# EAGLE design Due_RS422_Transceiver (EAGLE 9.5.2)
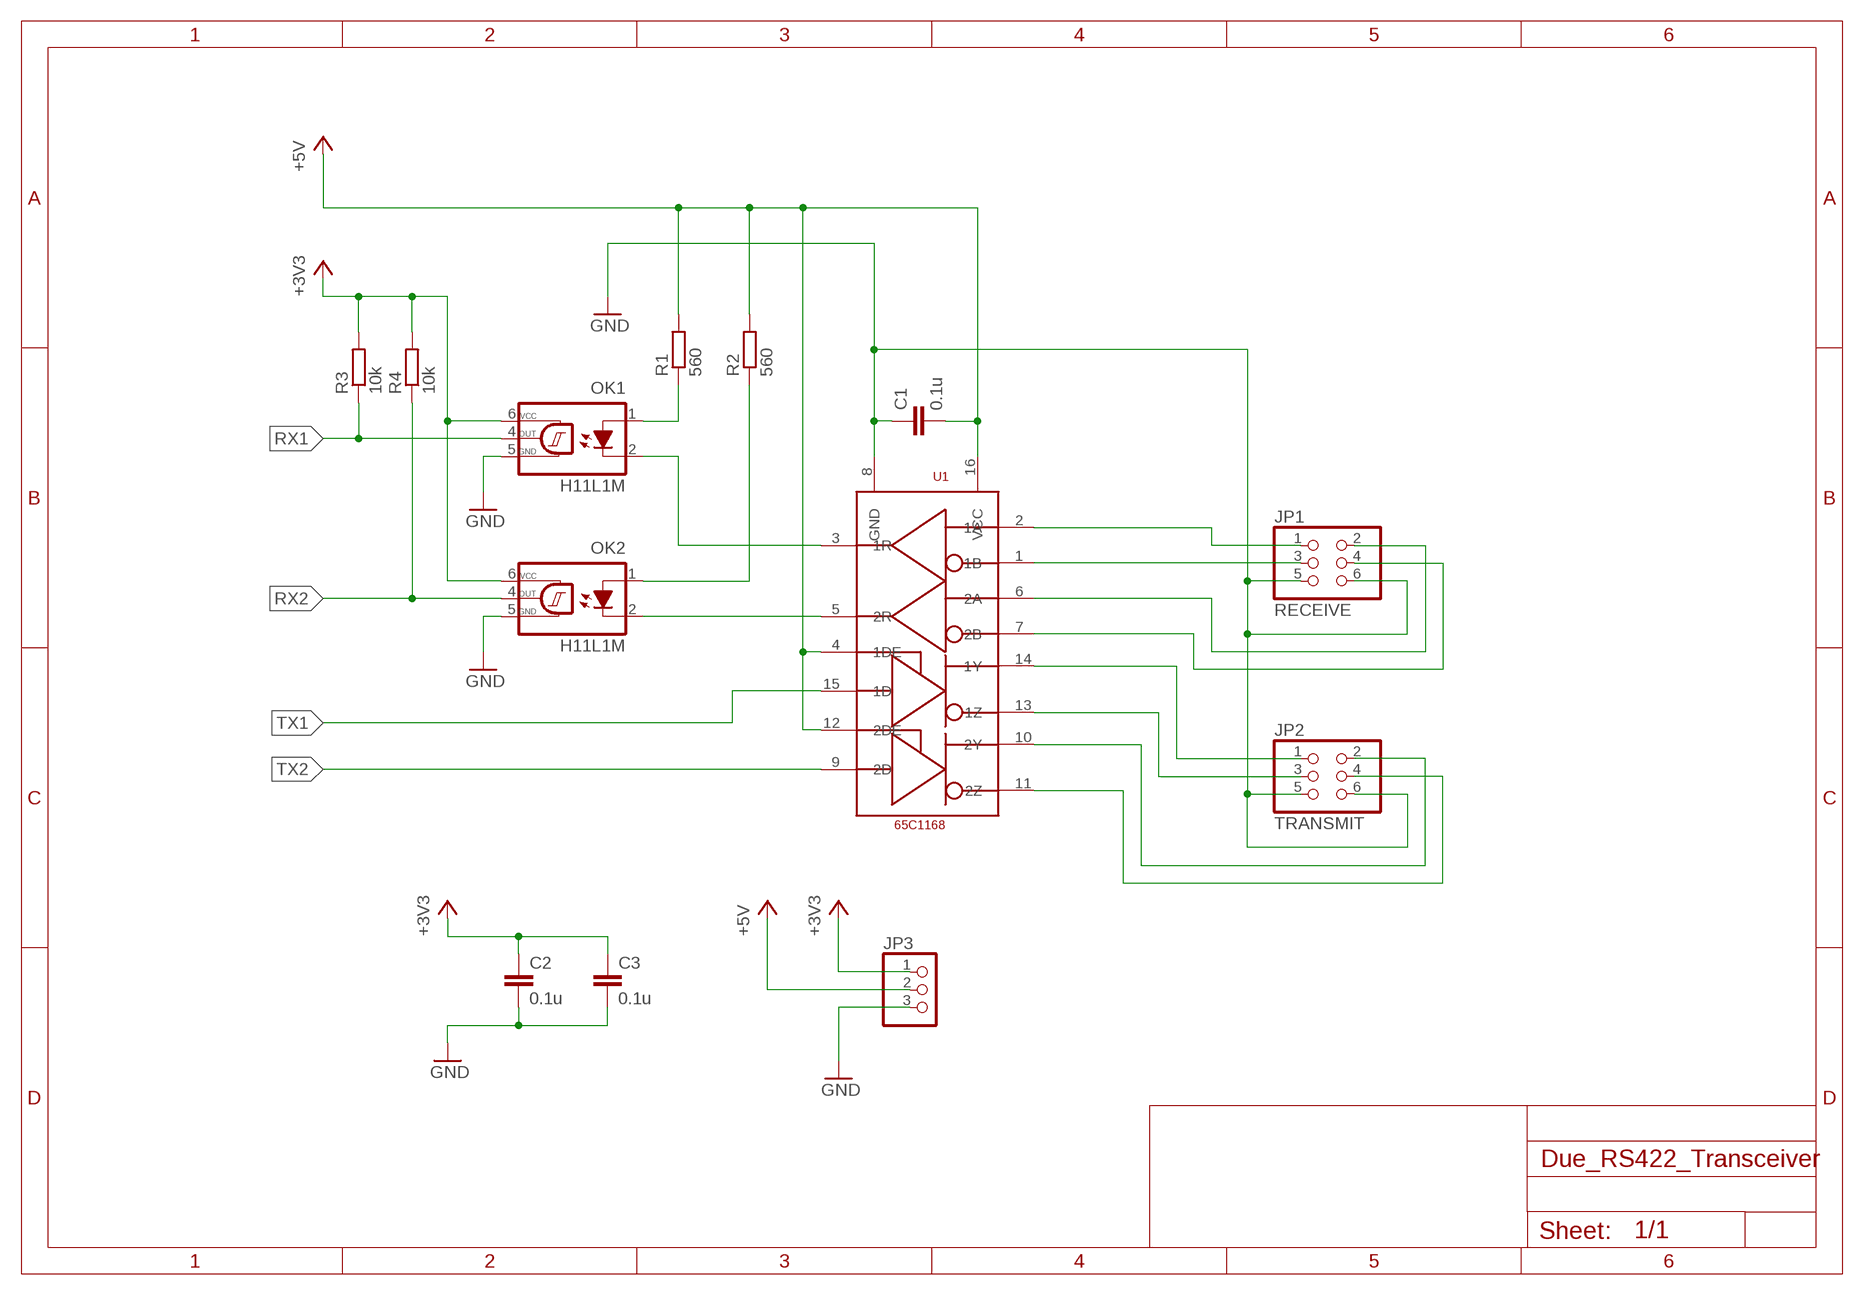
[diagram p0: schematic, sheet 1]

## Parts
C1  0.1u  C-EU050-030X075  [C050-030X075]
C2  0.1u  C-EU050-030X075  [C050-030X075]
C3  0.1u  C-EU050-030X075  [C050-030X075]
JP1  RECEIVE  PINHD-2X3  [2X03]
JP2  TRANSMIT  PINHD-2X3  [2X03]
JP3  PINHD-1X3  [1X03]
OK1  H11L1M  [DIL06]
OK2  H11L1M  [DIL06]
R1  560  R-EU_0204/7  [0204/7]
R2  560  R-EU_0204/7  [0204/7]
R3  10k  R-EU_0204/7  [0204/7]
R4  10k  R-EU_0204/7  [0204/7]
U1  65C1168  SN65C1168  [DIP16]

## Nets
+3V3: C2.1 C3.1 JP3.1 OK1.6(VCC) OK2.6(VCC) R3.2 R4.2
+5V: C1.2 JP3.2 R1.2 R2.2 U1.4(1DE) U1.12(2DE) U1.16(VCC)
GND: C1.1 C2.2 C3.2 JP1.5 JP1.6 JP2.5 JP2.6 JP3.3 OK1.5(GND) OK2.5(GND) U1.8(GND)
N$1: OK1.2(C) U1.3(1R)
N$2: OK2.2(C) U1.5(2R)
N$3: OK1.1(A) R1.1
N$4: OK2.1(A) R2.1
N$8: JP1.3 U1.1(1B)
N$9: JP1.1 U1.2(1A)
N$10: JP1.2 U1.6(2A)
N$11: JP1.4 U1.7(2B)
N$12: JP2.1 U1.14(1Y)
N$13: JP2.3 U1.13(1Z)
N$14: JP2.2 U1.10(2Y)
N$15: JP2.4 U1.11(2Z)
RX1: OK1.4(OUT) R3.1
RX2: OK2.4(OUT) R4.1
TX1: U1.15(1D)
TX2: U1.9(2D)

## Library data of the parts
C1-C3 = rcl:C-EU: CAPACITOR, European symbol; SPICEPREFIX: C
JP1 JP2 = pinhead:PINHD-2X3: PIN HEADER
JP3 = pinhead:PINHD-1X3: PIN HEADER
OK1 OK2 = optocoupler:H11L*M: 6-Pin DIP Optocoupler Source: http://www.fairchildsemi.com/ds/H1/H11L2-M.pdf; MF: FAIRCHILD SEMICONDUCTOR; MPN: H11L1-M; OC_FARNELL: 1021127; OC_NEWARK: 72K8643
R1-R4 = rcl:R-EU_: RESISTOR, European symbol; SPICEPREFIX: R
U1 = sb2030_logger:SN65C1168

## Board
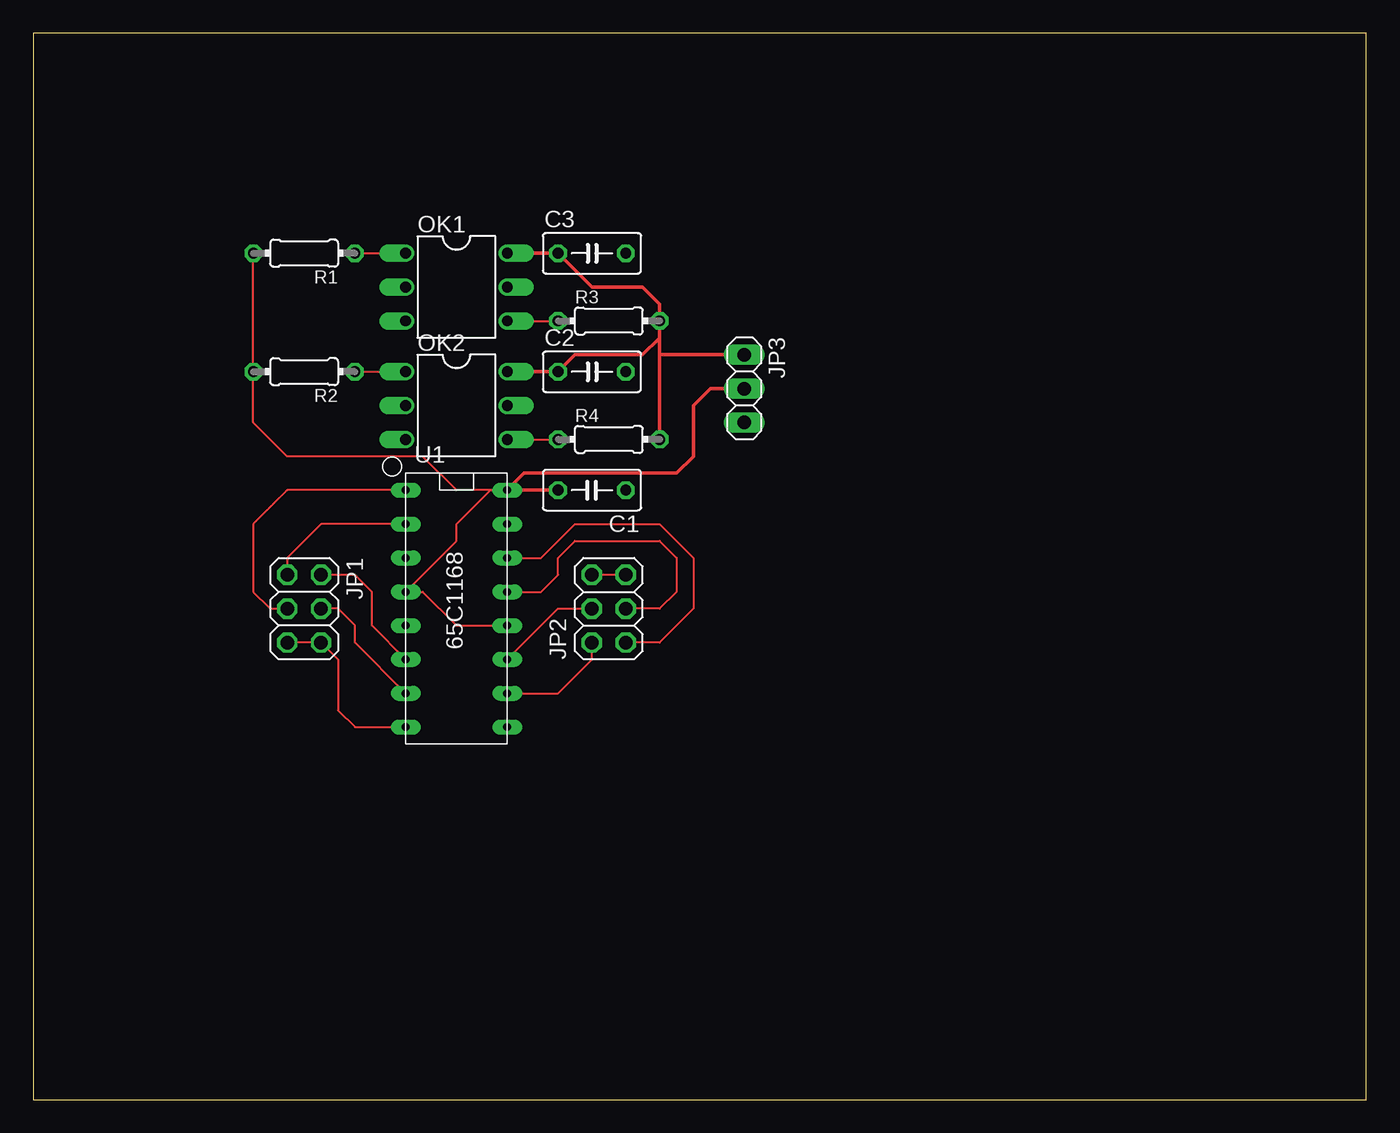
[diagram p1: board, top side]
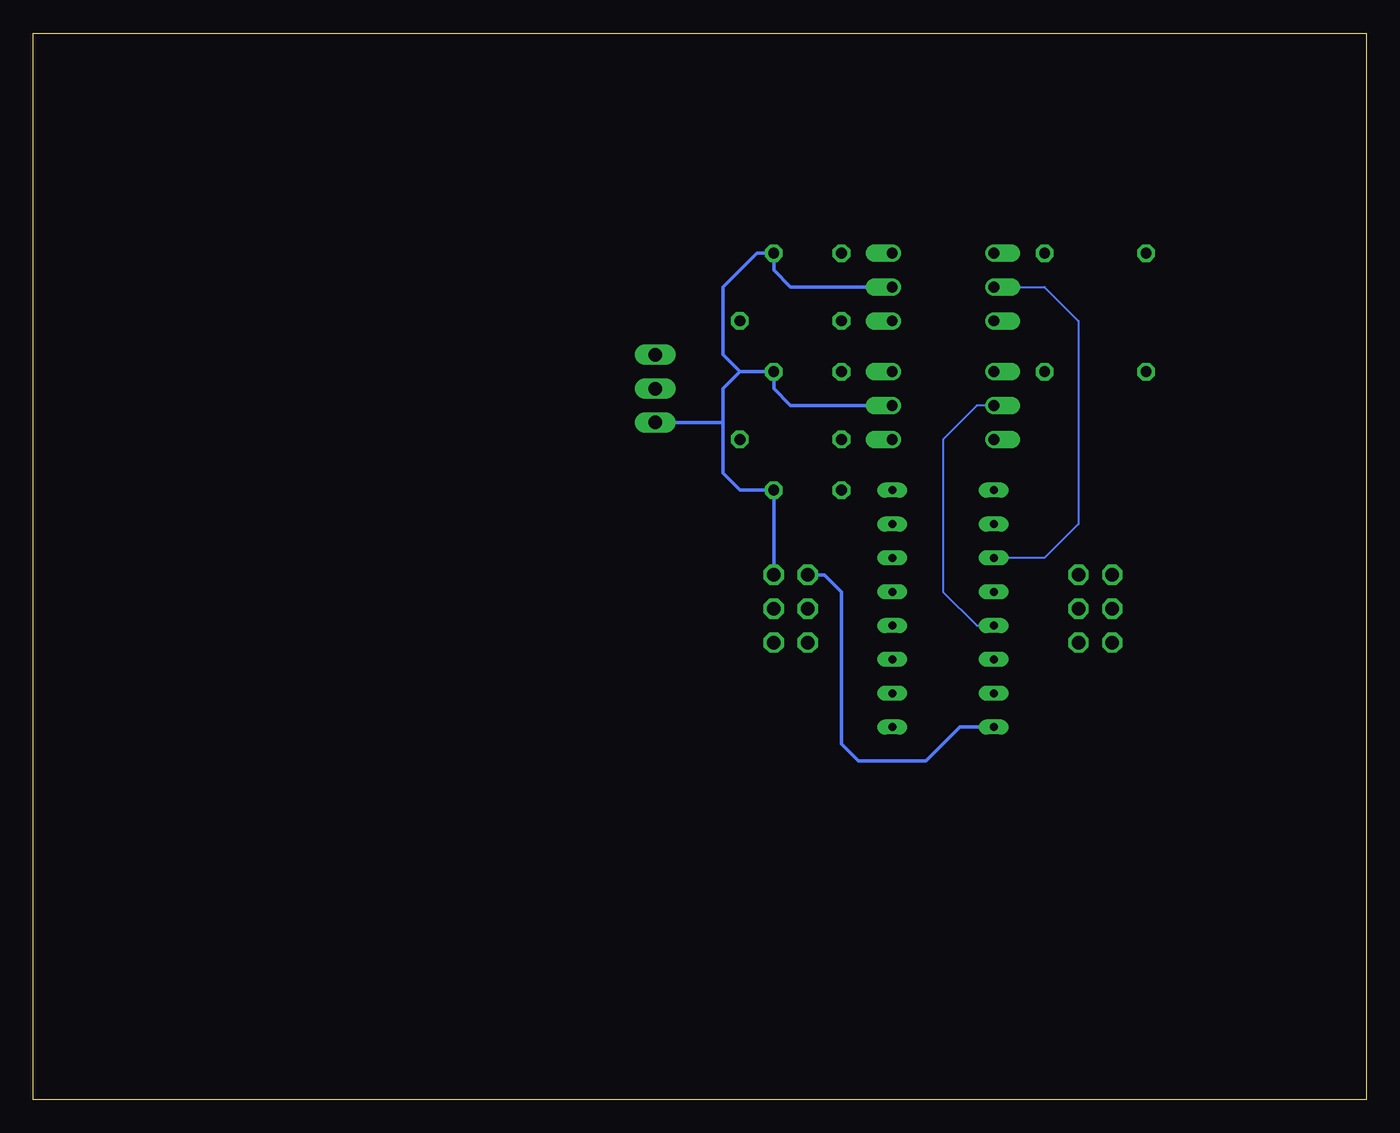
[diagram p2: board, bottom side, seen from below]

Size 100 x 80 mm. Coordinates in mm from the lower left corner, seen from the top.
Outline: 0,0 100,0 100,80 0,80 0,0
Copper layers (1*16): Top 0.035mm / dielectric 1.5mm / Bottom 0.035mm
Design rules "default": minimum track width 6mil, minimum drill 0.35mm, track to track 6mil, track to pad 6mil, pad to pad 6mil, via to via 6mil, smd to smd 6mil, copper to edge 40mil, drill to drill 6mil, minimum pad ring 10mil, minimum via ring 8mil, stop-mask expansion 4mil, vias tented up to drill 0mil, thermal gap 10mil

### Footprints (pad centres in the part's own frame; a part is rotated, then mirrored left to right if it is on the bottom)
C050-030X075 = drill 0.813 octagon: 1 -2.54,0; 2 2.54,0
2X03 = drill 1.016 octagon: 1 -2.54,-1.27; 2 -2.54,1.27; 3 0,-1.27; 4 0,1.27; 5 2.54,-1.27; 6 2.54,1.27
1X03 = drill 1.016 long: 1 -2.54,0; 2 0,0; 3 2.54,0
DIL06 = drill 0.813 offset: 1 -2.54,-3.81; 2 0,-3.81; 3 2.54,-3.81; 4 2.54,3.81; 5 0,3.81; 6 -2.54,3.81
0204/7 = drill 0.813 octagon: 1 -3.81,0; 2 3.81,0
DIP16 = drill 0.6 long: 1 -3.81,8.89; 2 -3.81,6.35; 3 -3.81,3.81; 4 -3.81,1.27; 5 -3.81,-1.27; 6 -3.81,-3.81; 7 -3.81,-6.35; 8 -3.81,-8.89; 9 3.81,-8.89; 10 3.81,-6.35; 11 3.81,-3.81; 12 3.81,-1.27; 13 3.81,1.27; 14 3.81,3.81; 15 3.81,6.35; 16 3.81,8.89

### Placement (x,y rotation side)
C1  41.91,45.72 180 top
C2  41.91,54.61 0 top
C3  41.91,63.5 0 top
JP1  20.32,36.83 270 top
JP2  43.18,36.83 90 top
JP3  53.34,53.34 270 top
OK1  31.75,60.96 270 top
OK2  31.75,52.07 270 top
R1  20.32,63.5 180 top
R2  20.32,54.61 180 top
R3  43.18,58.42 0 top
R4  43.18,49.53 0 top
U1  31.75,36.83 0 top

### Tracks (layer width: path | path; a pad name or v marks a point on that pad's centre or on a via)
+3V3
  Top 0.254: OK1.6 C3.1 41.91,60.96 45.72,60.96 46.99,59.69 R3.2 | R3.2 46.99,55.88 | 46.99,55.88 46.99,52.07 R4.2 | R3.2 46.99,57.15 45.72,55.88 40.64,55.88 C2.1 OK2.6 | JP3.1 46.99,55.88
+5V
  Top 0.152: U1.12 31.75,35.56 29.21,38.1 U1.4 31.75,41.91 31.75,43.18 34.29,45.72 U1.16 31.75,45.72 29.21,48.26 19.05,48.26 16.51,50.8 R2.2 R1.2
  Top 0.254: C1.2 U1.16 36.83,46.99 48.26,46.99 49.53,48.26 49.53,52.07 50.8,53.34 JP3.2
GND
  Top 0.152: JP1.5 JP1.6 22.86,33.02 22.86,29.21 24.13,27.94 U1.8 | JP2.5 JP2.6
  Bottom 0.254: 46.99,54.61 48.26,55.88 48.26,60.96 45.72,63.5 C3.2 44.45,62.23 43.18,60.96 OK1.5 | 46.99,54.61 C2.2 44.45,53.34 43.18,52.07 OK2.5 | 46.99,54.61 48.26,53.34 48.26,50.8 | 48.26,50.8 48.26,46.99 46.99,45.72 C1.1 JP2.5 | U1.8 30.48,27.94 33.02,25.4 38.1,25.4 39.37,26.67 39.37,38.1 40.64,39.37 JP2.6 | JP3.3 48.26,50.8
N$1
  Bottom 0.152: OK1.2 24.13,60.96 21.59,58.42 21.59,43.18 24.13,40.64 U1.3
N$2
  Bottom 0.152: OK2.2 29.21,52.07 31.75,49.53 31.75,38.1 29.21,35.56 U1.5
N$3
  Top 0.152: R1.1 OK1.1
N$4
  Top 0.152: R2.1 OK2.1
N$8
  Top 0.152: U1.1 19.05,45.72 16.51,43.18 16.51,38.1 17.78,36.83 JP1.3
N$9
  Top 0.152: U1.2 21.59,43.18 19.05,40.64 JP1.1
N$10
  Top 0.152: U1.6 25.4,35.56 25.4,38.1 24.13,39.37 JP1.2
N$11
  Top 0.152: U1.7 24.13,34.29 24.13,35.56 22.86,36.83 JP1.4
N$12
  Top 0.152: U1.14 38.1,40.64 40.64,43.18 46.99,43.18 49.53,40.64 49.53,36.83 46.99,34.29 JP2.1
N$13
  Top 0.152: U1.13 38.1,38.1 39.37,39.37 39.37,40.64 40.64,41.91 46.99,41.91 48.26,40.64 48.26,38.1 46.99,36.83 JP2.3
N$14
  Top 0.152: U1.10 39.37,30.48 41.91,33.02 JP2.2
N$15
  Top 0.152: U1.11 39.37,36.83 JP2.4
RX1
  Top 0.152: OK1.4 R3.1
RX2
  Top 0.152: OK2.4 R4.1